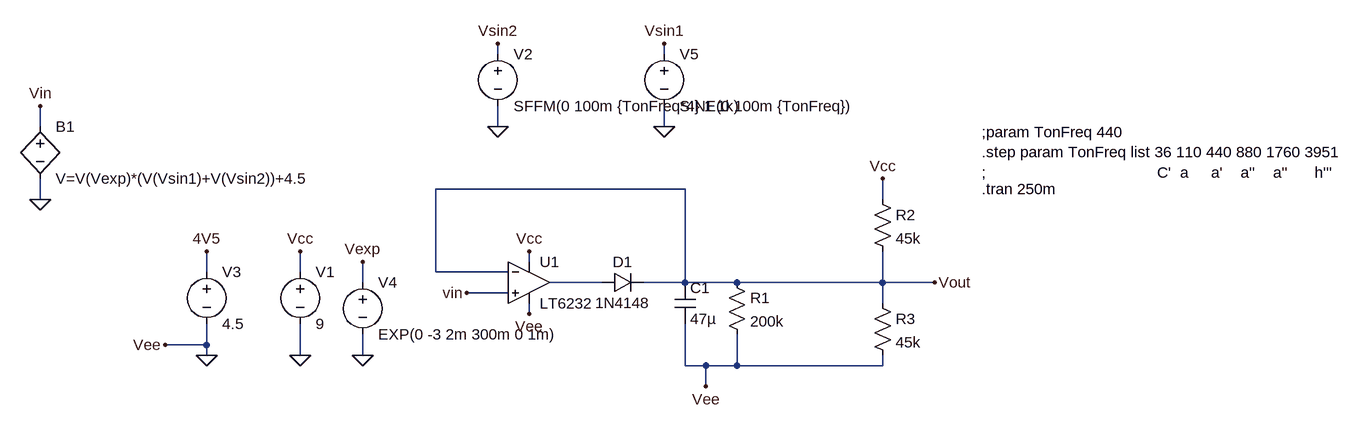
[diagram p0: schematic Hüllkurvendetektor_OpAmp_1Oberwelle.asc]
Hüllkurvendetektor_OpAmp_1Oberwelle.asc, the LTspice schematic file:
Version 4
SHEET 1 1584 680
WIRE 192 -160 192 -176
WIRE 448 -160 448 -176
WIRE -512 -48 -512 -80
WIRE 192 -48 192 -80
WIRE 448 -48 448 -80
WIRE 480 48 96 48
WIRE -512 64 -512 32
WIRE 784 64 784 32
WIRE 240 160 240 144
WIRE -256 176 -256 144
WIRE -112 176 -112 144
WIRE 96 176 96 48
WIRE 208 176 96 176
WIRE -16 192 -16 160
WIRE 352 192 272 192
WIRE 480 192 480 48
WIRE 480 192 416 192
WIRE 560 192 480 192
WIRE 784 192 784 144
WIRE 784 192 560 192
WIRE 864 192 784 192
WIRE 208 208 144 208
WIRE 784 224 784 192
WIRE 240 240 240 224
WIRE -256 288 -256 256
WIRE -256 288 -320 288
WIRE -256 304 -256 288
WIRE -112 304 -112 256
WIRE -16 304 -16 272
WIRE 480 320 480 256
WIRE 512 320 480 320
WIRE 560 320 560 272
WIRE 560 320 512 320
WIRE 784 320 784 304
WIRE 784 320 560 320
WIRE 512 352 512 320
FLAG -112 304 0
FLAG -256 304 0
FLAG -256 144 4V5
FLAG -512 -80 Vin
FLAG -112 144 Vcc
FLAG 240 144 Vcc
FLAG 240 240 Vee
FLAG 864 192 Vout
FLAG 512 352 Vee
FLAG -320 288 Vee
FLAG 144 208 vin
FLAG 784 32 Vcc
FLAG -16 304 0
FLAG -16 160 Vexp
FLAG -512 64 0
FLAG 192 -48 0
FLAG 448 -48 0
FLAG 448 -176 Vsin1
FLAG 192 -176 Vsin2
SYMBOL Opamps\\LT6232 240 192 R0
SYMATTR InstName U1
SYMBOL voltage -112 160 R0
WINDOW 123 0 0 Left 2
WINDOW 39 0 0 Left 2
SYMATTR InstName V1
SYMATTR Value 9
SYMBOL voltage 192 -176 R0
WINDOW 123 0 0 Left 2
WINDOW 39 0 0 Left 2
SYMATTR InstName V2
SYMATTR Value SFFM(0 100m {TonFreq*4} 1 1k)
SYMBOL voltage -256 160 R0
WINDOW 123 0 0 Left 2
WINDOW 39 0 0 Left 2
SYMATTR InstName V3
SYMATTR Value 4.5
SYMBOL voltage -16 176 R0
WINDOW 123 0 0 Left 2
WINDOW 39 24 124 Left 2
SYMATTR InstName V4
SYMATTR Value EXP(0 -3 2m 300m 0 1m)
SYMBOL cap 464 192 R0
SYMATTR InstName C1
SYMATTR Value 47µ
SYMBOL res 544 176 R0
SYMATTR InstName R1
SYMATTR Value 200k
SYMBOL diode 352 208 R270
WINDOW 0 32 32 VTop 2
WINDOW 3 0 32 VBottom 2
SYMATTR InstName D1
SYMATTR Value 1N4148
SYMBOL res 768 48 R0
SYMATTR InstName R2
SYMATTR Value 45k
SYMBOL res 768 208 R0
SYMATTR InstName R3
SYMATTR Value 45k
SYMBOL voltage 448 -176 R0
WINDOW 123 0 0 Left 2
WINDOW 39 0 0 Left 2
SYMATTR InstName V5
SYMATTR Value SINE(0 100m {TonFreq})
SYMBOL bv -512 -64 R0
SYMATTR InstName B1
SYMATTR Value V=V(Vexp)*(V(Vsin1)+V(Vsin2))+4.5
TEXT 936 48 Left 2 !.tran 250m
TEXT 936 -40 Left 2 !;param TonFreq 440\n.step param TonFreq list 36 110 440 880 1760 3951\n;                                      C'  a     a'    a''    a''      h'''

The netlist it stands for:
* Hüllkurvendetektor_OpAmp_1Oberwelle.asc
* U1: LT6232 (symbol Opamps\LT6232 not available, pins judged from their places): In+=Vin In-=Vout V+=Vcc V-=0 OUT=N001
V1 Vcc 0 9
V2 Vsin2 0 SFFM(0 100m {TonFreq*4} 1 1k)
V3 4V5 0 4.5
V4 Vexp 0 EXP(0 -3 2m 300m 0 1m)
C1 Vout 0 47µ
R1 Vout 0 200k
D1 N001 Vout 1N4148
R2 Vcc Vout 45k
R3 Vout 0 45k
V5 Vsin1 0 SINE(0 100m {TonFreq})
B1 Vin 0 V=V(Vexp)*(V(Vsin1)+V(Vsin2))+4.5
.model D D
.lib standard.dio
.tran 250m
;param TonFreq 440
.step param TonFreq list 36 110 440 880 1760 3951
;                                      C'  a     a'    a''    a''      h'''
.backanno
.end